# EAGLE design baballe (EAGLE 7.6.0)
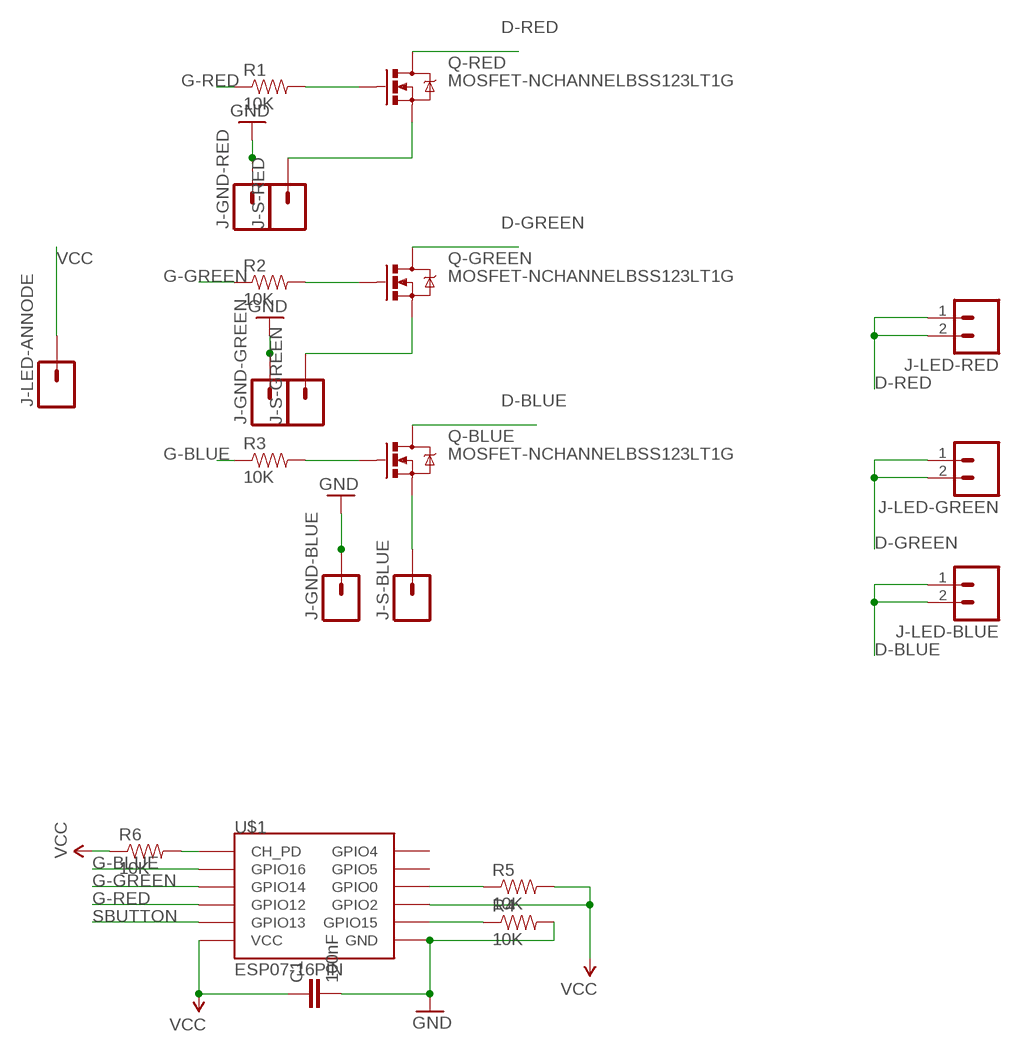
[diagram p0: schematic, sheet 1]

## Parts
C1  100nF  CAP0805  [0805]
J-GND-BLUE  M01PTH  [1X01]
J-GND-GREEN  M01PTH  [1X01]
J-GND-RED  M01PTH  [1X01]
J-LED-ANNODE  M01  [1X01-SMALL]
J-LED-BLUE  M02  [1X02_SQUARE]
J-LED-GREEN  M02  [1X02_SQUARE]
J-LED-RED  M02  [1X02_SQUARE]
J-S-BLUE  M01PTH  [1X01]
J-S-GREEN  M01PTH  [1X01]
J-S-RED  M01PTH  [1X01]
Q-BLUE  MOSFET-NCHANNELBSS123LT1G  [SOT23-3]
Q-GREEN  MOSFET-NCHANNELBSS123LT1G  [SOT23-3]
Q-RED  MOSFET-NCHANNELBSS123LT1G  [SOT23-3]
R1  10K  RESISTOR0805-RES  [0805]
R2  10K  RESISTOR0805-RES  [0805]
R3  10K  RESISTOR0805-RES  [0805]
R4  10K  RESISTOR0805-RES  [0805]
R5  10K  RESISTOR0805-RES  [0805]
R6  10K  RESISTOR0805-RES  [0805]
U$1  ESP07-16PIN  [ESP07-16PIN]

## Nets
D-BLUE: J-LED-BLUE.1 J-LED-BLUE.2 Q-BLUE.3(D)
D-GREEN: J-LED-GREEN.1 J-LED-GREEN.2 Q-GREEN.3(D)
D-RED: J-LED-RED.1 J-LED-RED.2 Q-RED.3(D)
G-BLUE: R3.1 U$1.GPIO16
G-GREEN: R2.1 U$1.GPIO14
G-RED: R1.1 U$1.GPIO12
GND: C1.2 J-GND-BLUE.1 J-GND-GREEN.1 J-GND-RED.1 R4.2 U$1.GND
N$1: Q-RED.1(G) R1.2
N$2: Q-GREEN.1(G) R2.2
N$3: Q-BLUE.1(G) R3.2
N$4: R6.2 U$1.CH_PD
N$5: R5.1 U$1.GPIO0
N$6: R4.1 U$1.GPIO15
N$7: J-S-RED.1 Q-RED.2(S)
N$8: J-S-GREEN.1 Q-GREEN.2(S)
N$9: J-S-BLUE.1 Q-BLUE.2(S)
SBUTTON: U$1.GPIO13
VCC: C1.1 J-LED-ANNODE.1 R5.2 R6.1 U$1.GPIO2 U$1.VCC
Unconnected: U$1.GPIO4 U$1.GPIO5

## Library data of the parts
C1 = SparkFun-Passives:CAP: Capacitor Standard 0603 ceramic capacitor, and 0.1" leaded capacitor.
J-GND-BLUE J-GND-GREEN J-GND-RED J-LED-ANNODE J-S-BLUE J-S-GREEN J-S-RED = SparkFun-Connectors:M01: Header 1 Standard 1-pin 0.1" header. Use with straight break away headers (SKU : PRT-00116), right angle break away headers (PRT-00553), swiss pins (PRT-00743), machine pins (PRT-00117), and female headers (PRT-00115). SMTSO-256-ET is a "flush mount" nut for a 4-40 screw. The older package used to be too tight, and did not allow it to sit properly thru the drill hit. The latest (0.165DIA) fits nice and snug.
J-LED-BLUE J-LED-GREEN J-LED-RED = SparkFun-Connectors:M02: Standard 2-pin 0.1" header. Use with - straight break away headers ( PRT-00116) - right angle break away headers (PRT-00553) - swiss pins (PRT-00743) - machine pins (PRT-00117) - female headers (PRT-00115) Molex polarized connector foot print use with: PRT-08233 with associated crimp pins and housings. 2.54_SCREWTERM for use with PRT-10571. 3.5mm Screw Terminal footprints for PRT-08084 5mm Screw Terminal footprints for use with PRT-08432
Q-BLUE Q-GREEN Q-RED = SparkFun-DiscreteSemi:MOSFET-NCHANNEL: Common NMOSFET Parts MFG P/N Store ID Prod ID FDD8780 TRANS-09984 SI7820DN TRANS-11055 FDS6630A IC-08089 2N7002PW TRANS-11151 FQP30N06L COM-10213 TRANS-10060 BSS123LT1G TRANS-08345 BSS138 TRANS-00830 BS170 2N7000; PROD_ID: TRANS-08345
R1-R6 = SparkFun-Passives:RESISTOR: Resistor Basic schematic elements and footprints for 0603, 1206, and PTH resistors.
U$1 = baballe-module:ESP07-16PIN: Baballe Module pour ESP8266-07; DIMENSIONS: 22.0 x 16.0 mm; PINS: 16; PITCH: 0.078" / 2 mm

## Net classes
0 default: width 0.051 mm, clearance 0.025 mm

## Board
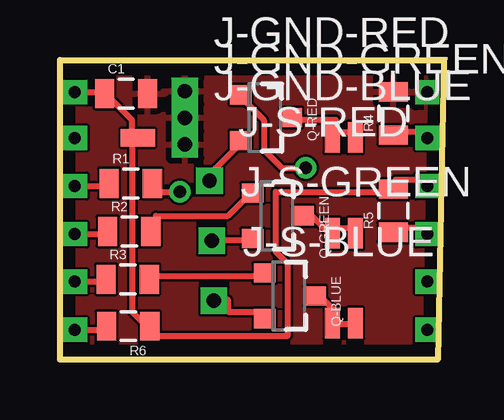
[diagram p1: board, top side]
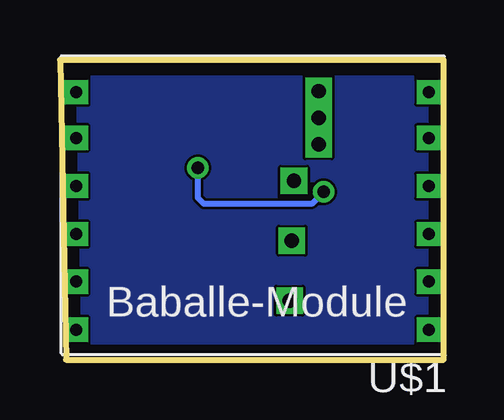
[diagram p2: board, bottom side, seen from below]

Size 16 x 12.5 mm. Coordinates in mm from the lower left corner, seen from the top.
Outline: 16,12.5 15.75,0 0,0 0,12.5 16,12.5
Copper layers (1*16): Top 0.035mm / dielectric 1.5mm / Bottom 0.035mm
Design rules "DRC": minimum track width 10mil, minimum drill 20mil, track to track 4mil, track to pad 4mil, pad to pad 2mil, via to via 2mil, smd to smd 2mil, copper to edge 20mil, drill to drill 8mil, minimum pad ring 10mil, minimum via ring 8mil, stop-mask expansion 4mil, vias tented up to drill 0mil, thermal gap 10mil

### Footprints (pad centres in the part's own frame; a part is rotated, then mirrored left to right if it is on the bottom)
0805 = smd 0.8 x 1.2: 1 -0.9,0; 2 0.9,0
1X01 = drill 0.6 pad 0.813 square: 1 0,0
1X01-SMALL = smd 0.711 x 1.422: 1 0,0
1X02_SQUARE = smd 0.635 x 1.27: 1 -0.635,1.27; 2 0.318,1.27
SOT23-3 = smd 0.8 x 0.9: 1 -0.95,-1; 2 0.95,-1; 3 0,1.1
ESP07-16PIN = drill 0.5 square: CH_PD -7.239,1.803; GND 7.468,-8.103; GPIO0 7.468,-2.184; GPIO2 7.468,-4.191; GPIO4 7.468,1.803; GPIO5 7.468,-0.203; GPIO12 -7.239,-4.191; GPIO13 -7.239,-6.198; GPIO14 -7.239,-2.184; GPIO15 7.468,-6.198; GPIO16 -7.239,-0.203; VCC -7.239,-8.103

### Placement (x,y rotation side)
C1  2.76,11.1 0 top
J-GND-BLUE  5.21,8.97 0 top
J-GND-GREEN  5.22,10.08 0 top
J-GND-RED  5.21,11.2 0 top
J-LED-ANNODE  3.25,9.25 90 top
J-LED-BLUE  12,0.25 0 top
J-LED-GREEN  12,4 0 top
J-LED-RED  12,8 0 top
J-S-BLUE  6.42,2.46 0 top
J-S-GREEN  6.33,4.96 0 top
J-S-RED  6.24,7.46 0 top
Q-BLUE  9.54,2.66 270 top
Q-GREEN  9.04,6 270 top
Q-RED  8.54,10.09 270 top
R1  2.95,7.35 0 top
R2  2.89,5.35 0 top
R3  2.83,3.35 0 top
R4  13.9,10.27 90 top
R5  13.9,6.21 90 top
R6  2.85,1.4 180 top
U$1  7.86,3.05 180 bottom

### Tracks (layer width: path | path; a pad name or v marks a point on that pad's centre or on a via)
D-BLUE
  Top 0.254: Q-BLUE.3 11,2.5 11.5,2 J-LED-BLUE.1 11.5,1.5 12.5,1.5 J-LED-BLUE.2
D-GREEN
  Top 0.254: Q-GREEN.3 10.5,6 11.5,5 J-LED-GREEN.1 11.5,5.5 12.5,5.5 J-LED-GREEN.2
D-RED
  Top 0.254: 11.5,9.5 11.5,10 10,10 Q-RED.3 | 11.5,9.5 12.5,9.5 J-LED-RED.2 | 11.5,9.5 J-LED-RED.1
G-BLUE
  Top 0.254: U$1.GPIO16 1.93,3.25 R3.1
G-GREEN
  Top 0.254: U$1.GPIO14 1.99,5.23 R2.1
G-RED
  Top 0.254: U$1.GPIO12 1.94,7.24 R1.1
GND
  pour Top: 0,12.75 15.75,12.75 16,0 0,0
N$1  (via drill 0.51)
  Top 0.254: v5,7 4,7 R1.2 | Q-RED.1 7.5,11 8.5,10 8.5,8.75 9.25,8 v10.25,8
  Bottom 0.254: v5,7 5.5,6.5 10,6.5 10.25,6.75 v10.25,8
N$2
  Top 0.254: Q-GREEN.1 8,7 7,6 4,6 4,5.5 R2.2
N$3
  Top 0.254: Q-BLUE.1 8.5,3.5 4,3.5 R3.2
N$4
  Top 0.254: U$1.CH_PD 1.95,1.25 R6.2
N$5
  Top 0.254: R5.1 14,5.5 15,5.5 U$1.GPIO0
N$6
  Top 0.254: R4.1 14,9.5 15,9.5 U$1.GPIO15
N$7
  Top 0.254: Q-RED.2 7.5,9 6.5,8 6.5,7.5 J-S-RED.1
N$8
  Top 0.254: Q-GREEN.2 8,5 6.5,5 J-S-GREEN.1
N$9
  Top 0.254: Q-BLUE.2 8.5,2 7,2 7,2.5 J-S-BLUE.1
N$10
  pour Bottom: 0,12.5 16,12.5 16,0 0,0
VCC
  Top 0.254: U$1.VCC 1.86,11.15 C1.1 2,11 3,10 3,9.5 J-LED-ANNODE.1 3,9 3,2 3.5,1.5 R6.1 4,1 9.5,1 9.5,4 9,4.5 9,7 13.5,7 R5.2 14,7.5 15,7.5 U$1.GPIO2